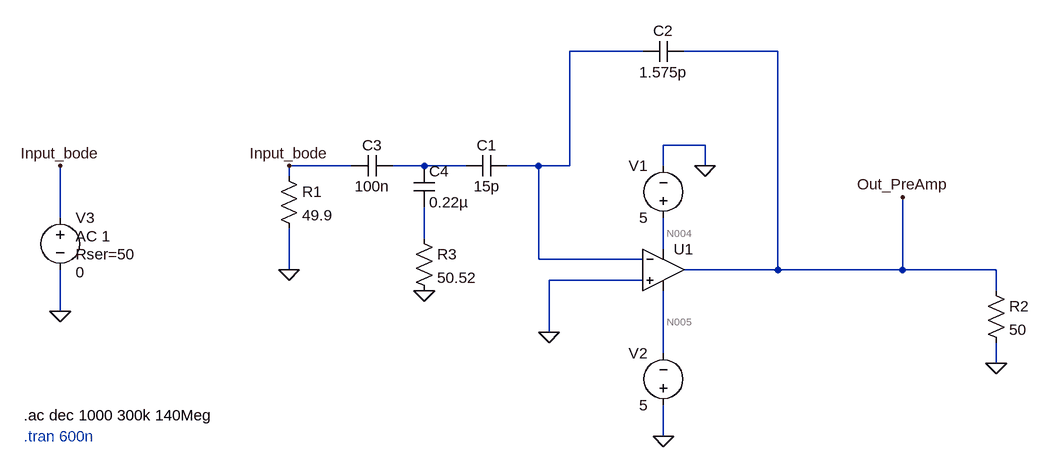
[diagram p0: schematic preamp_no_calib.asc]
preamp_no_calib.asc, the LTspice schematic file:
Version 4
SHEET 1 880 680
WIRE 256 -176 144 -176
WIRE 464 -176 320 -176
WIRE 352 -32 288 -32
WIRE -192 0 -288 0
WIRE -80 0 -128 0
WIRE -16 0 -80 0
WIRE 96 0 48 0
WIRE 144 0 144 -176
WIRE 144 0 96 0
WIRE 288 0 288 -32
WIRE 352 0 352 -32
WIRE -288 16 -288 0
WIRE -640 80 -640 0
WIRE -80 112 -80 64
WIRE 288 128 288 80
WIRE 96 144 96 0
WIRE 256 144 96 144
WIRE -288 160 -288 96
WIRE 464 160 464 -176
WIRE 464 160 320 160
WIRE 656 160 656 48
WIRE 656 160 464 160
WIRE 800 160 656 160
WIRE 256 176 112 176
WIRE 800 192 800 160
WIRE -640 224 -640 160
WIRE 112 256 112 176
WIRE 288 288 288 192
WIRE 800 304 800 272
WIRE 288 416 288 368
FLAG -640 224 0
FLAG -640 0 Input_bode
FLAG 288 416 0
FLAG 352 0 0
FLAG 112 256 0
FLAG 656 48 Out_PreAmp
FLAG -288 0 Input_bode
FLAG -288 160 0
FLAG 800 304 0
FLAG -80 192 0
SYMBOL voltage 288 96 R180
WINDOW 0 24 96 Left 2
WINDOW 3 24 16 Left 2
WINDOW 123 0 0 Left 0
WINDOW 39 0 0 Left 0
SYMATTR InstName V1
SYMATTR Value 5
SYMBOL voltage 288 384 R180
WINDOW 0 24 96 Left 2
WINDOW 3 24 16 Left 2
WINDOW 123 0 0 Left 0
WINDOW 39 0 0 Left 0
SYMATTR InstName V2
SYMATTR Value 5
SYMBOL OpAmps\\UniversalOpAmp1 288 160 R0
SYMATTR InstName U1
SYMATTR Value2 Avol=1900 GBW=897.0831Meg Vos=0
SYMBOL voltage -640 64 R0
WINDOW 123 24 44 Left 2
WINDOW 39 24 72 Left 2
WINDOW 3 24 100 Left 2
SYMATTR Value2 AC 1
SYMATTR SpiceLine Rser=50
SYMATTR Value 0
SYMATTR InstName V3
SYMBOL cap 48 -16 R90
WINDOW 0 0 32 VBottom 2
WINDOW 3 32 32 VTop 2
SYMATTR InstName C1
SYMATTR Value 15p
SYMATTR SpiceLine Rser=0
SYMBOL cap 320 -192 R90
WINDOW 0 0 32 VBottom 2
WINDOW 3 32 32 VTop 2
SYMATTR InstName C2
SYMATTR Value 1.575p
SYMATTR SpiceLine Rser=0
SYMBOL res -304 0 R0
SYMATTR InstName R1
SYMATTR Value 49.9
SYMBOL res 784 176 R0
SYMATTR InstName R2
SYMATTR Value 50
SYMBOL cap -128 -16 R90
WINDOW 0 0 32 VBottom 2
WINDOW 3 32 32 VTop 2
SYMATTR InstName C3
SYMATTR Value 100n
SYMBOL cap -96 0 R0
SYMATTR InstName C4
SYMATTR Value 0.22µ
SYMBOL res -96 96 R0
SYMATTR InstName R3
SYMATTR Value 50.52
TEXT -696 416 Left 2 ;.tran 600n
TEXT -696 384 Left 2 !.ac dec 1000 300k 140Meg

The netlist it stands for:
* preamp_no_calib.asc
V1 N004 0 5
V2 0 N005 5
XU1 0 N001 N004 N005 Out_PreAmp level1 Avol=1900 GBW=897.0831Meg Vos=0 En=0 Enk=0 In=0 Ink=0 Rin=500Meg  ; pins In+ In- V+ V- OUT
V3 Input_bode 0 0 AC 1 Rser=50
C1 N001 N002 15p Rser=0
C2 Out_PreAmp N001 1.575p Rser=0
R1 Input_bode 0 49.9
R2 Out_PreAmp 0 50
C3 N002 Input_bode 100n
C4 N002 N003 0.22µ
R3 N003 0 50.52
* .tran 600n
.ac dec 1000 300k 140Meg
.lib UniversalOpAmp1.lib
.backanno
.end

* Results of the author's LTspice run, read from the files saved beside the schematic
* Operating Point, zero values left out:
*   V(n004) = 5 V
*   V(n005) = -5 V
*   I(V1) = -10 nA
*   I(V2) = -10 nA
*   Ix(u1:3) = 10 nA
*   Ix(u1:4) = -10 nA
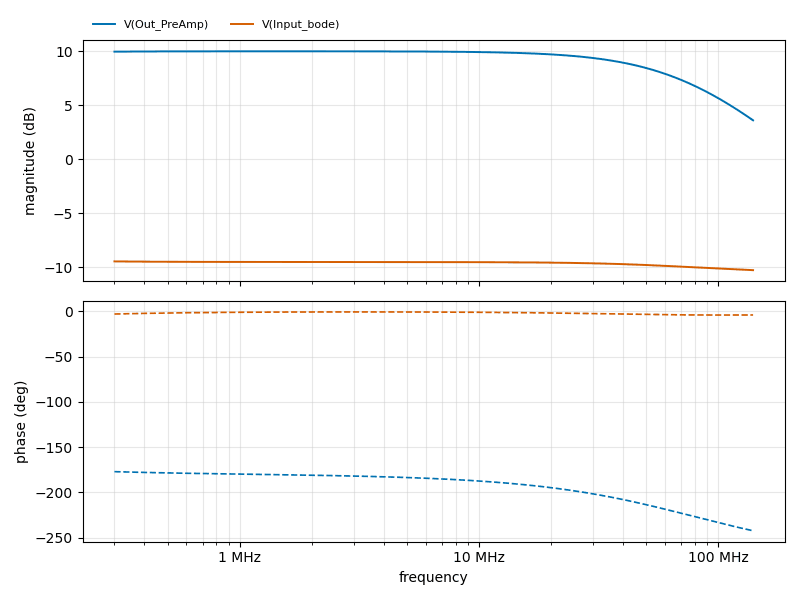
[diagram p1: AC Analysis of preamp_no_calib.asc, plotted from the saved traces]
* AC Analysis, 1 run:
*   V(Out_PreAmp): 9.97 dB at 300 kHz, 3.61 dB at 140 MHz, peak 10.01 dB at 1.439 MHz, 3 dB below the peak at 76.39 MHz
*   V(Input_bode): -9.46 dB at 300 kHz, -10.27 dB at 140 MHz, peak -9.46 dB at 300 kHz